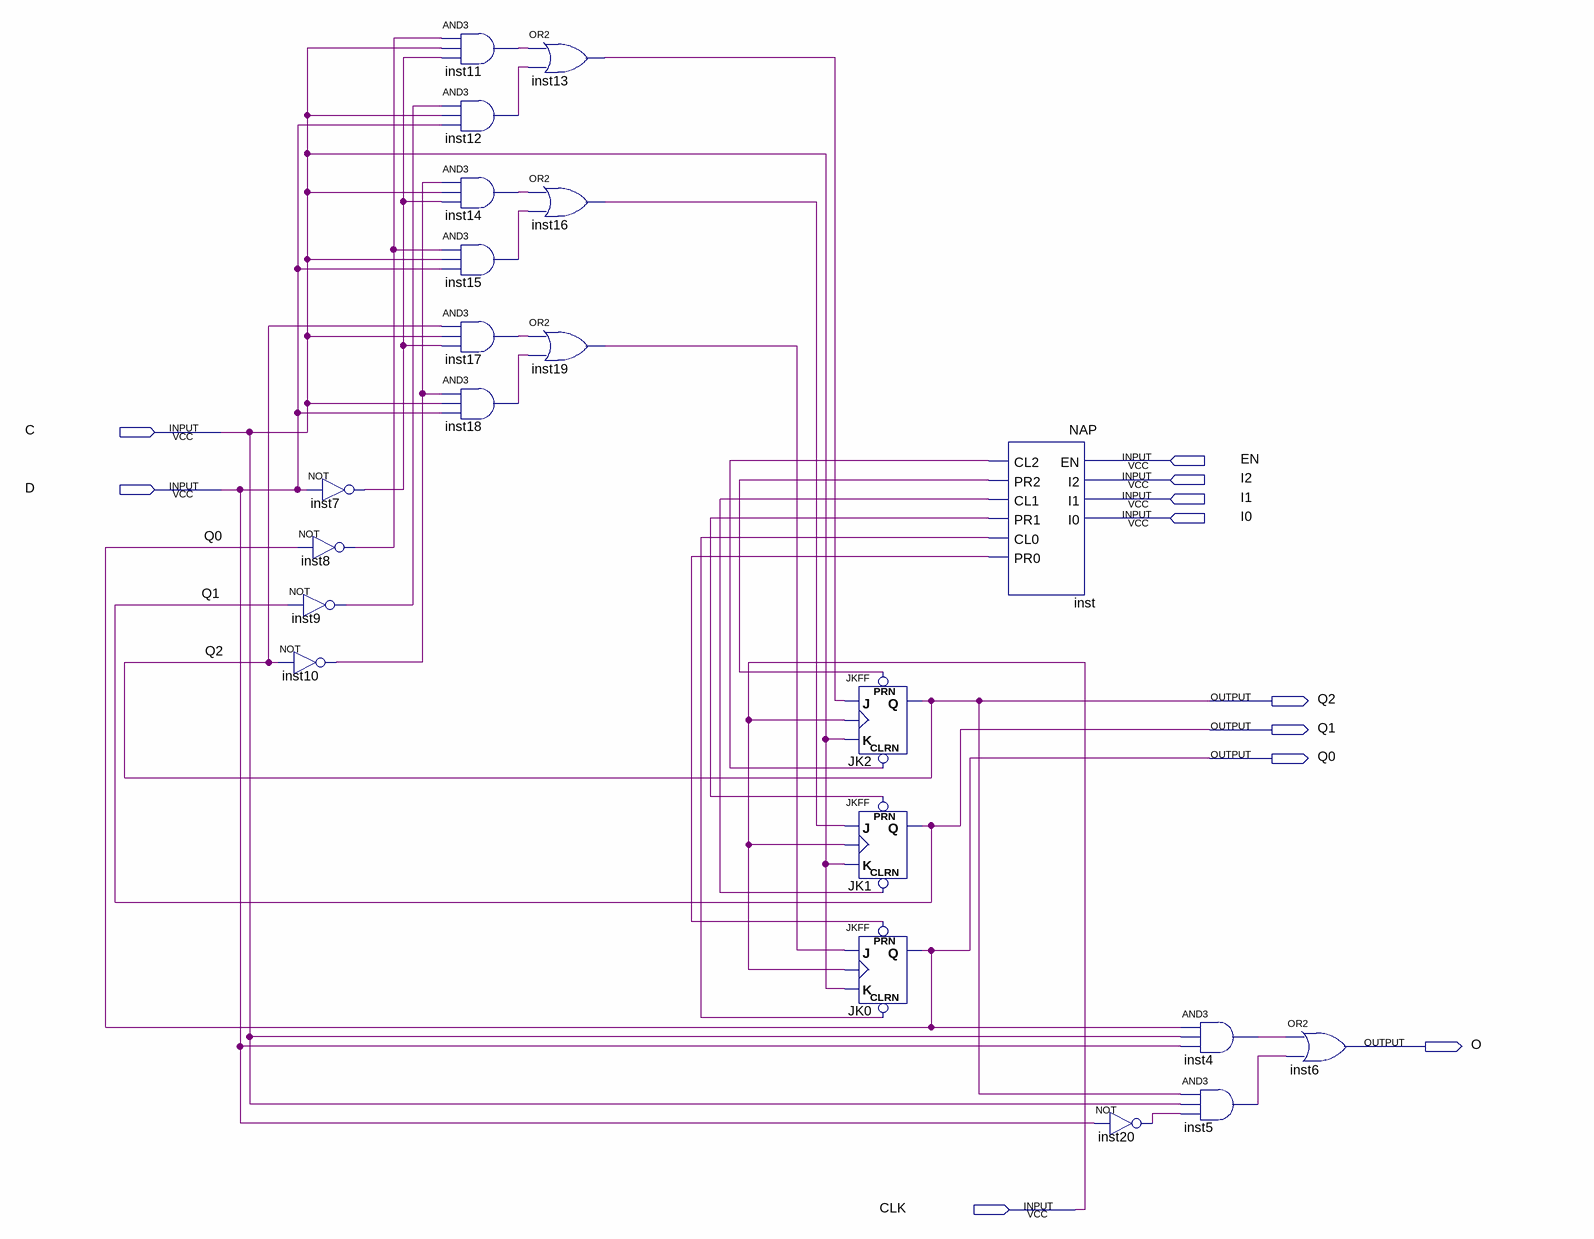
[diagram p0: schematic sheet]
// Quartus schematic Bai1.bdf as structural Verilog: 21 symbols, 11 pins
module Bai1 (
  input  C,
  input  EN,
  input  I2,
  input  D,
  input  I1,
  input  I0,
  input  CLK,
  output Q2,
  output Q1,
  output Q0,
  output O
);

  wire inst4_out, inst5_out, inst7_out, inst8_out, inst9_out, inst10_out, inst11_out, inst12_out, inst13_out,
       inst14_out, inst15_out, inst16_out, inst17_out, inst18_out, inst19_out, inst20_out, inst_cl0,
       inst_cl1, inst_cl2, inst_pr0, inst_pr1, inst_pr2;

  not inst7 (inst7_out, D);
  not inst8 (inst8_out, Q0);
  not inst9 (inst9_out, Q1);
  not inst10 (inst10_out, Q2);
  and inst11 (inst11_out, inst8_out, C, inst7_out);
  and inst12 (inst12_out, inst9_out, C, D);
  and inst14 (inst14_out, inst10_out, C, inst7_out);
  and inst15 (inst15_out, inst8_out, C, D);
  and inst17 (inst17_out, Q2, C, inst7_out);
  and inst18 (inst18_out, inst10_out, C, D);
  or inst13 (inst13_out, inst11_out, inst12_out);
  or inst16 (inst16_out, inst14_out, inst15_out);
  or inst19 (inst19_out, inst17_out, inst18_out);
  JKFF JK2 (.PRN(inst_pr2), .CLRN(inst_cl2), .K(C), .J(inst13_out), .CLK(CLK), .Q(Q2));
  JKFF JK1 (.PRN(inst_pr1), .CLRN(inst_cl1), .K(C), .J(inst16_out), .CLK(CLK), .Q(Q1));
  JKFF JK0 (.PRN(inst_pr0), .CLRN(inst_cl0), .K(C), .J(inst19_out), .CLK(CLK), .Q(Q0));
  NAP inst (
    .EN(EN), .I2(I2), .I1(I1), .I0(I0), .CL2(inst_cl2), .PR2(inst_pr2), .CL1(inst_cl1), .PR1(inst_pr1),
    .CL0(inst_cl0), .PR0(inst_pr0));
  not inst20 (inst20_out, D);
  and inst4 (inst4_out, Q0, C, D);
  and inst5 (inst5_out, Q2, C, inst20_out);
  or inst6 (O, inst4_out, inst5_out);
endmodule
